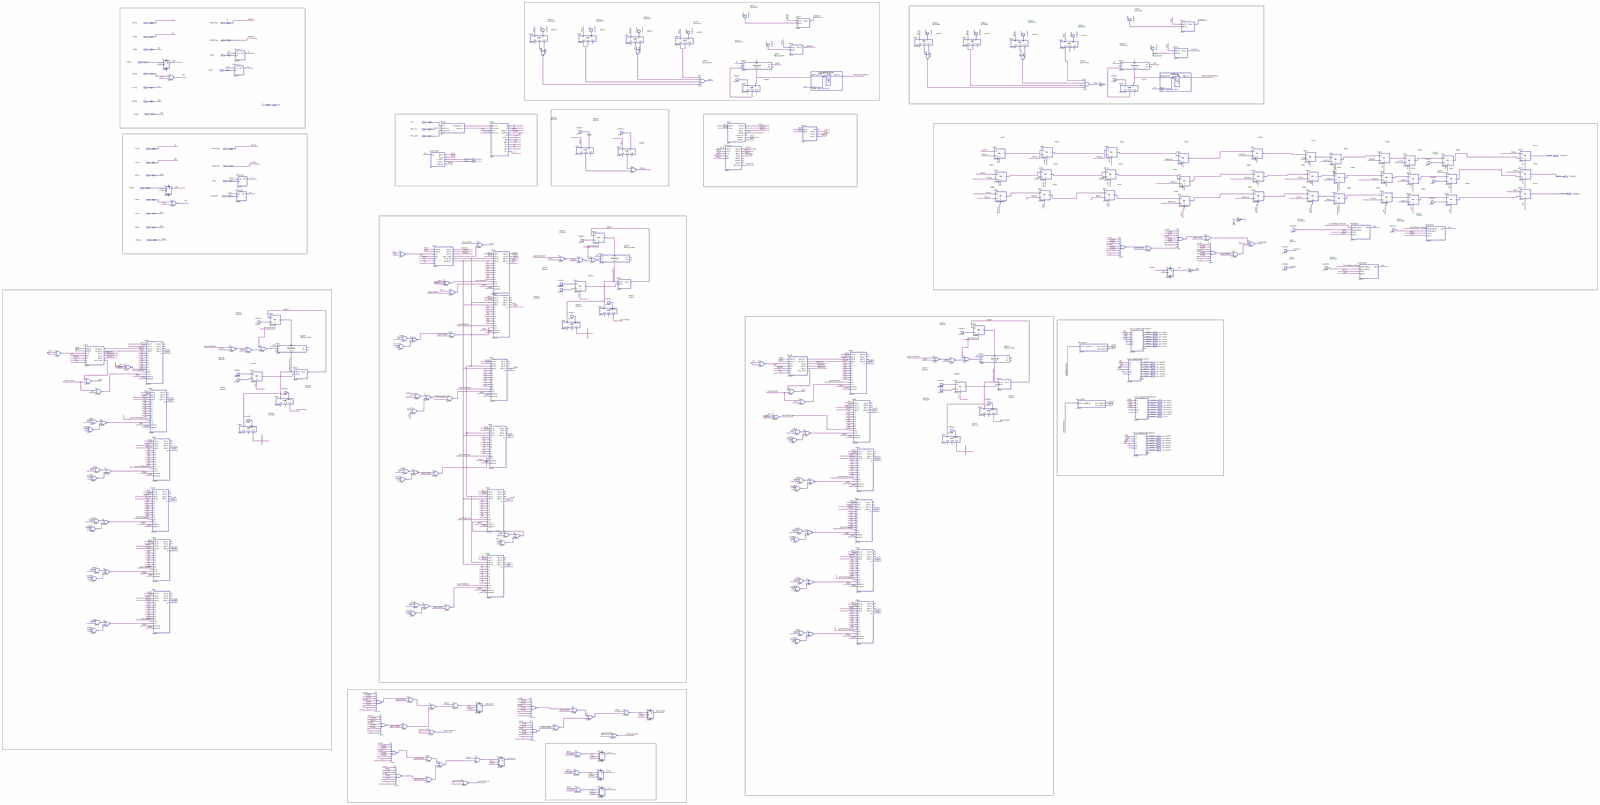
[diagram p0: schematic sheet, whole]
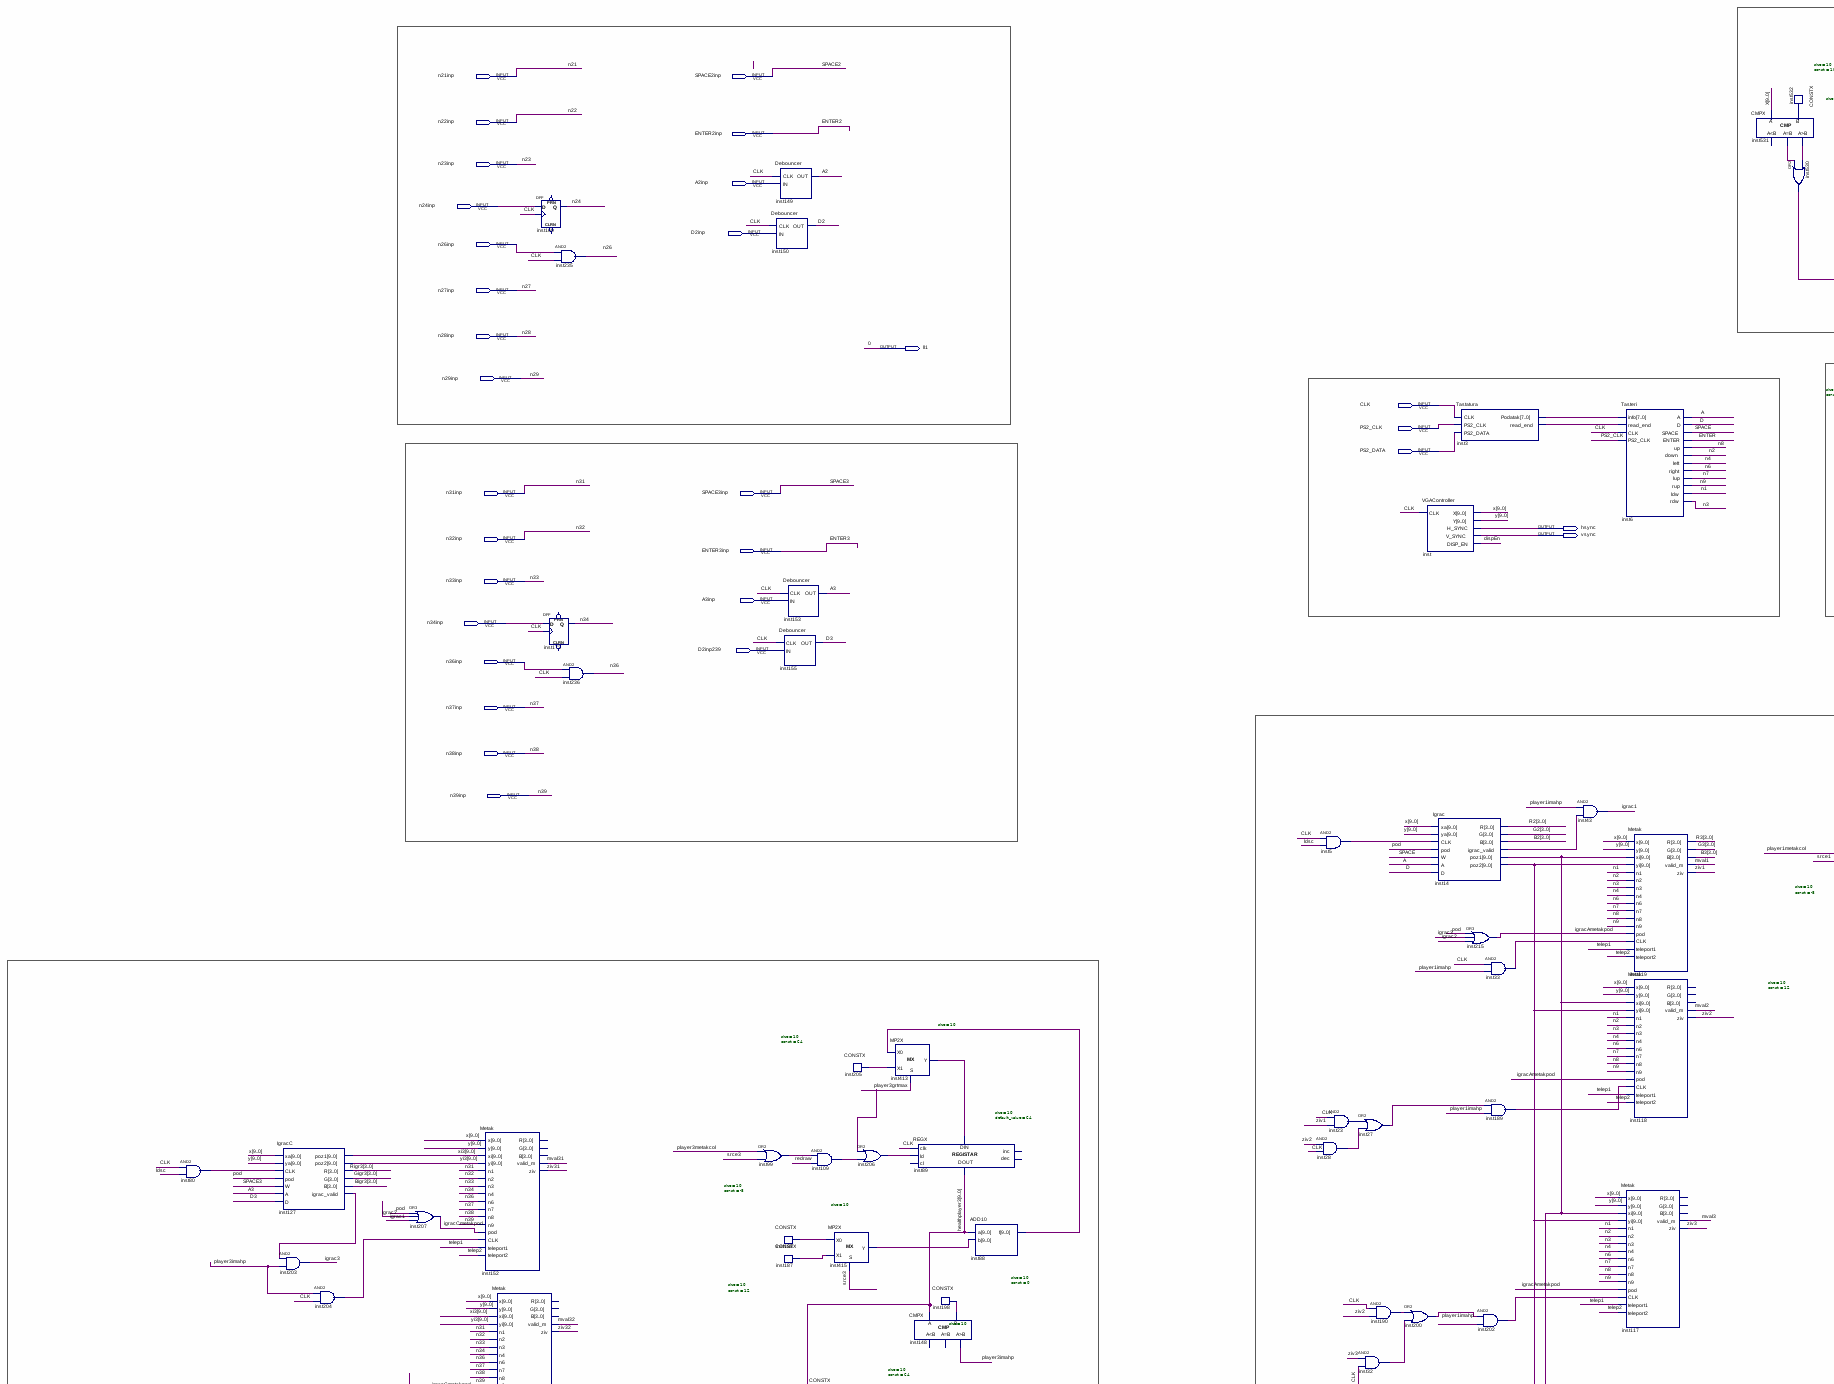
[diagram p1: schematic sheet, upper left part]
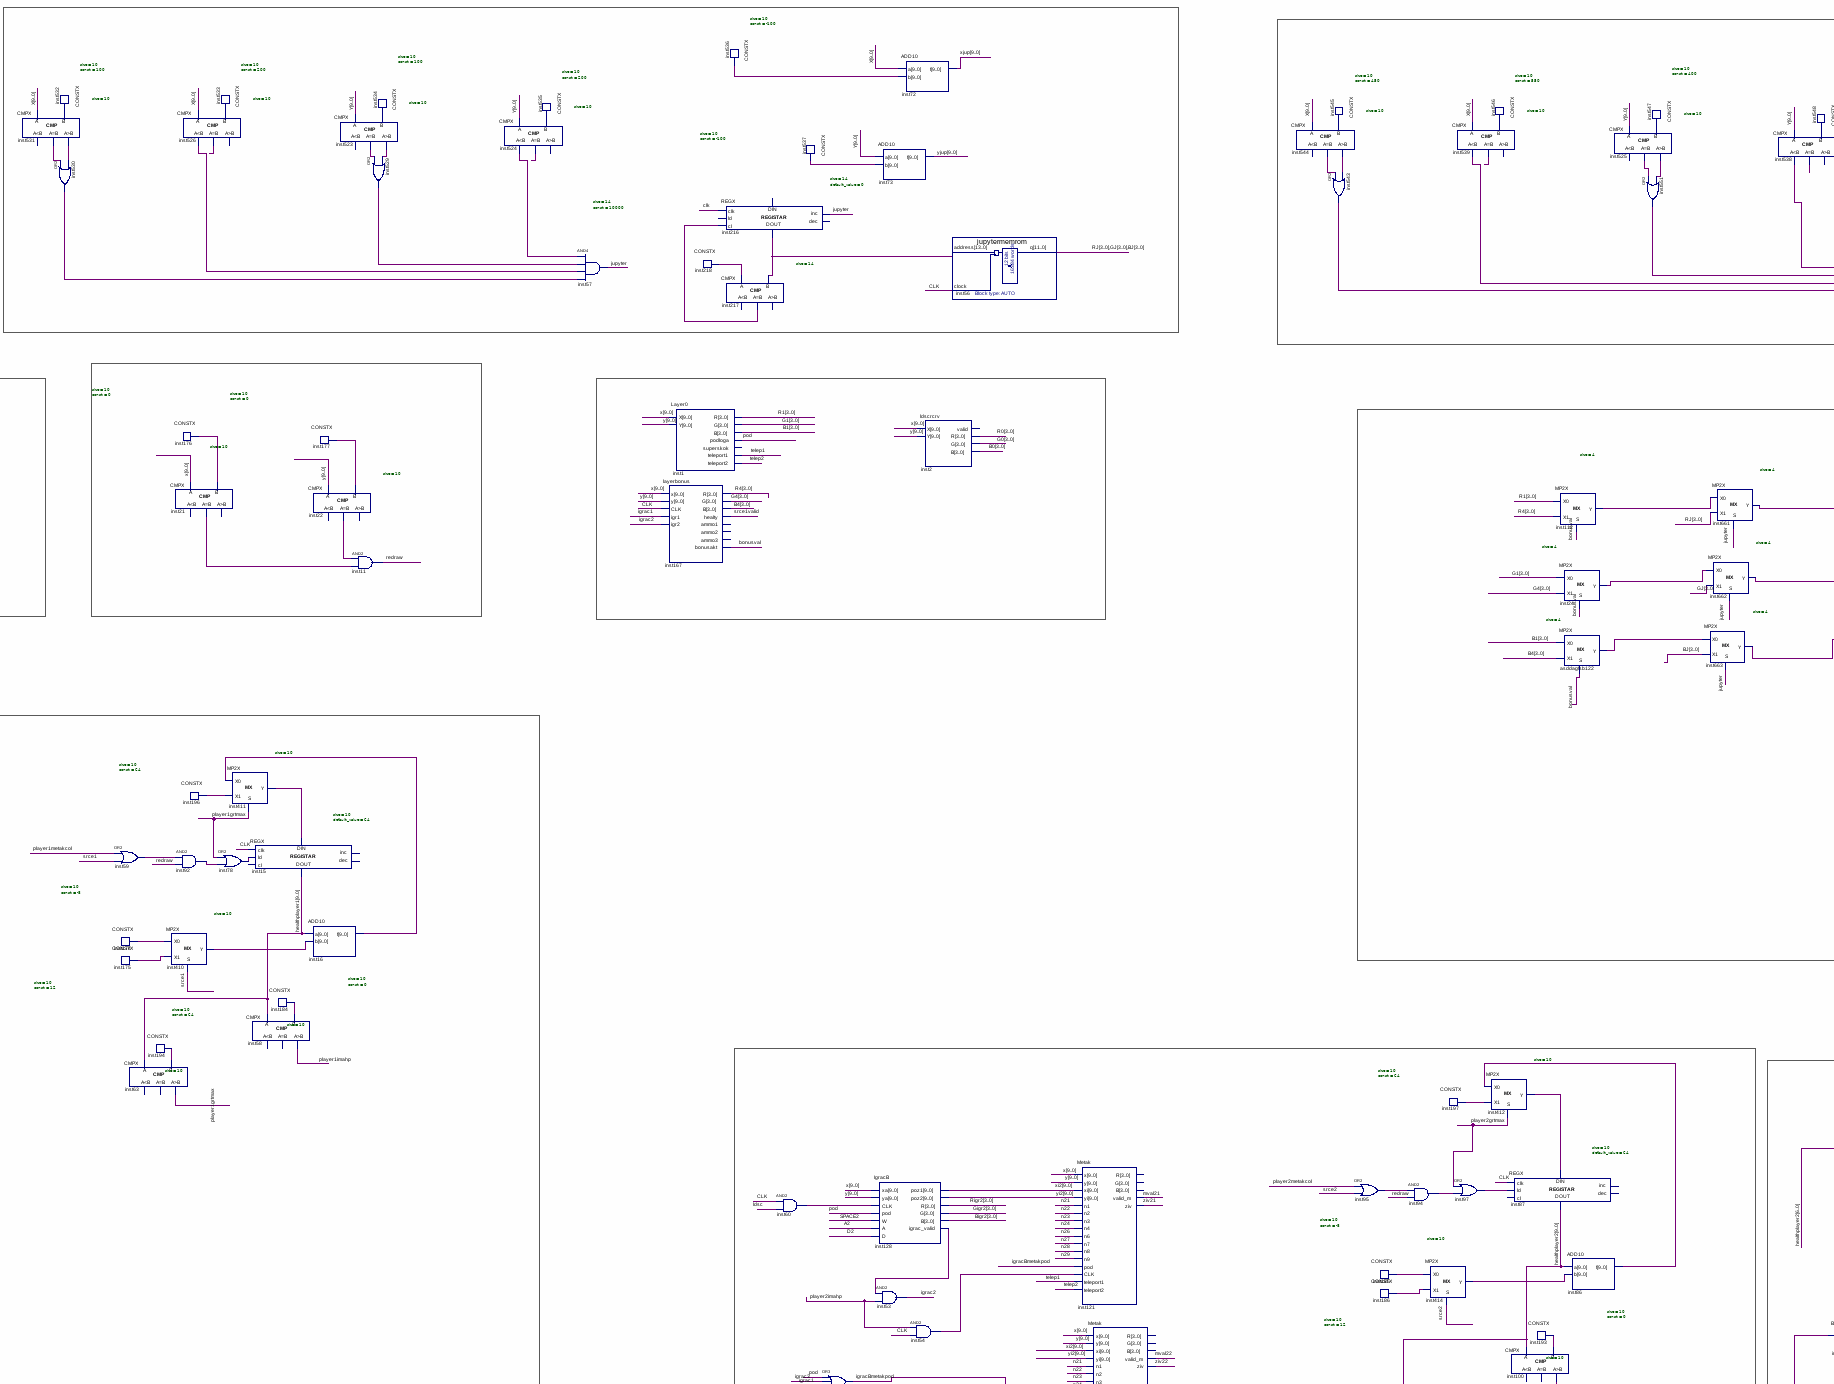
[diagram p2: schematic sheet, upper centre part]
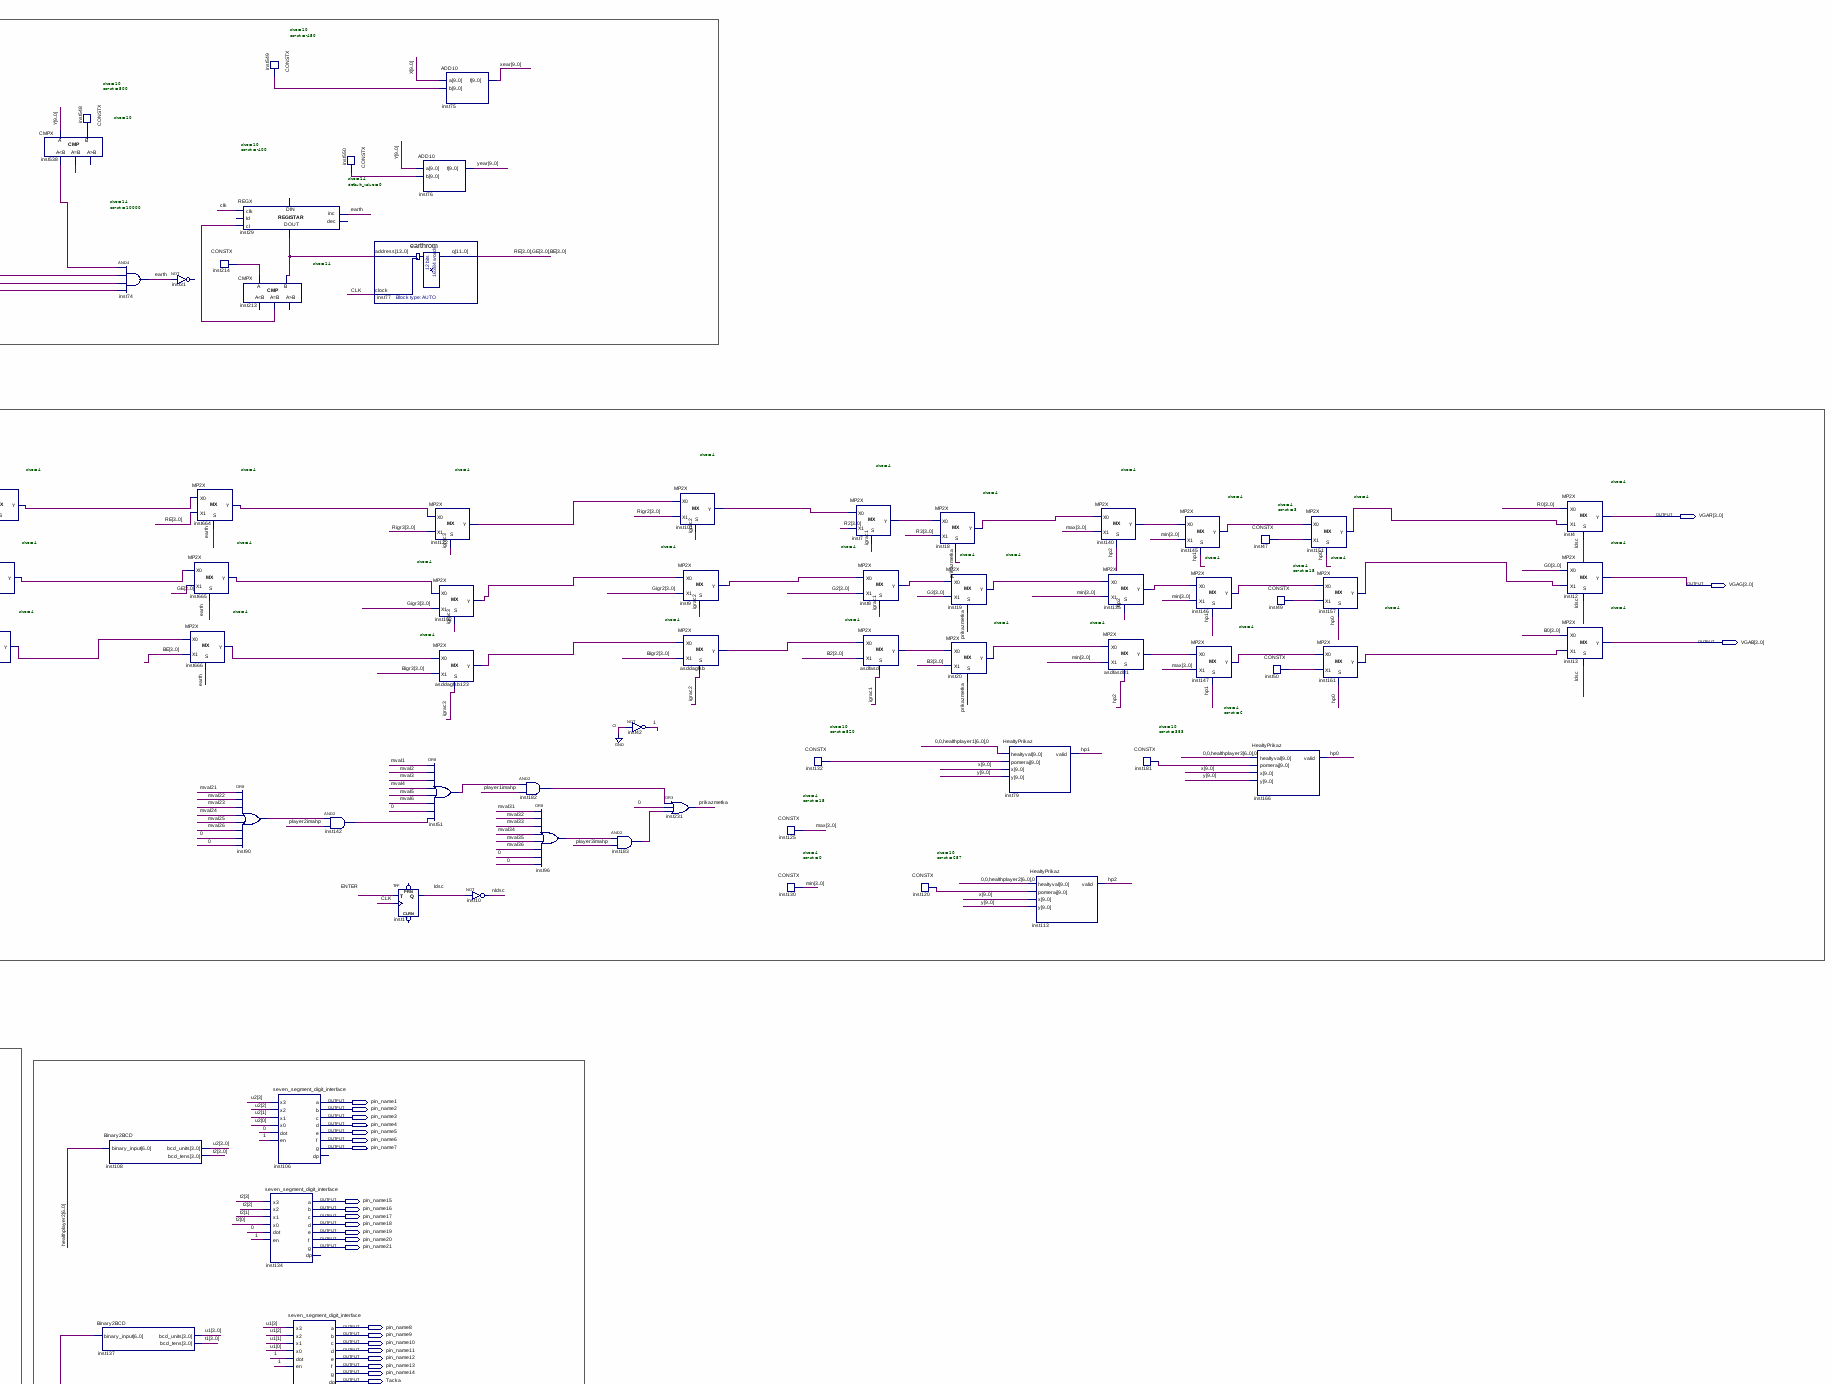
[diagram p3: schematic sheet, upper right part]
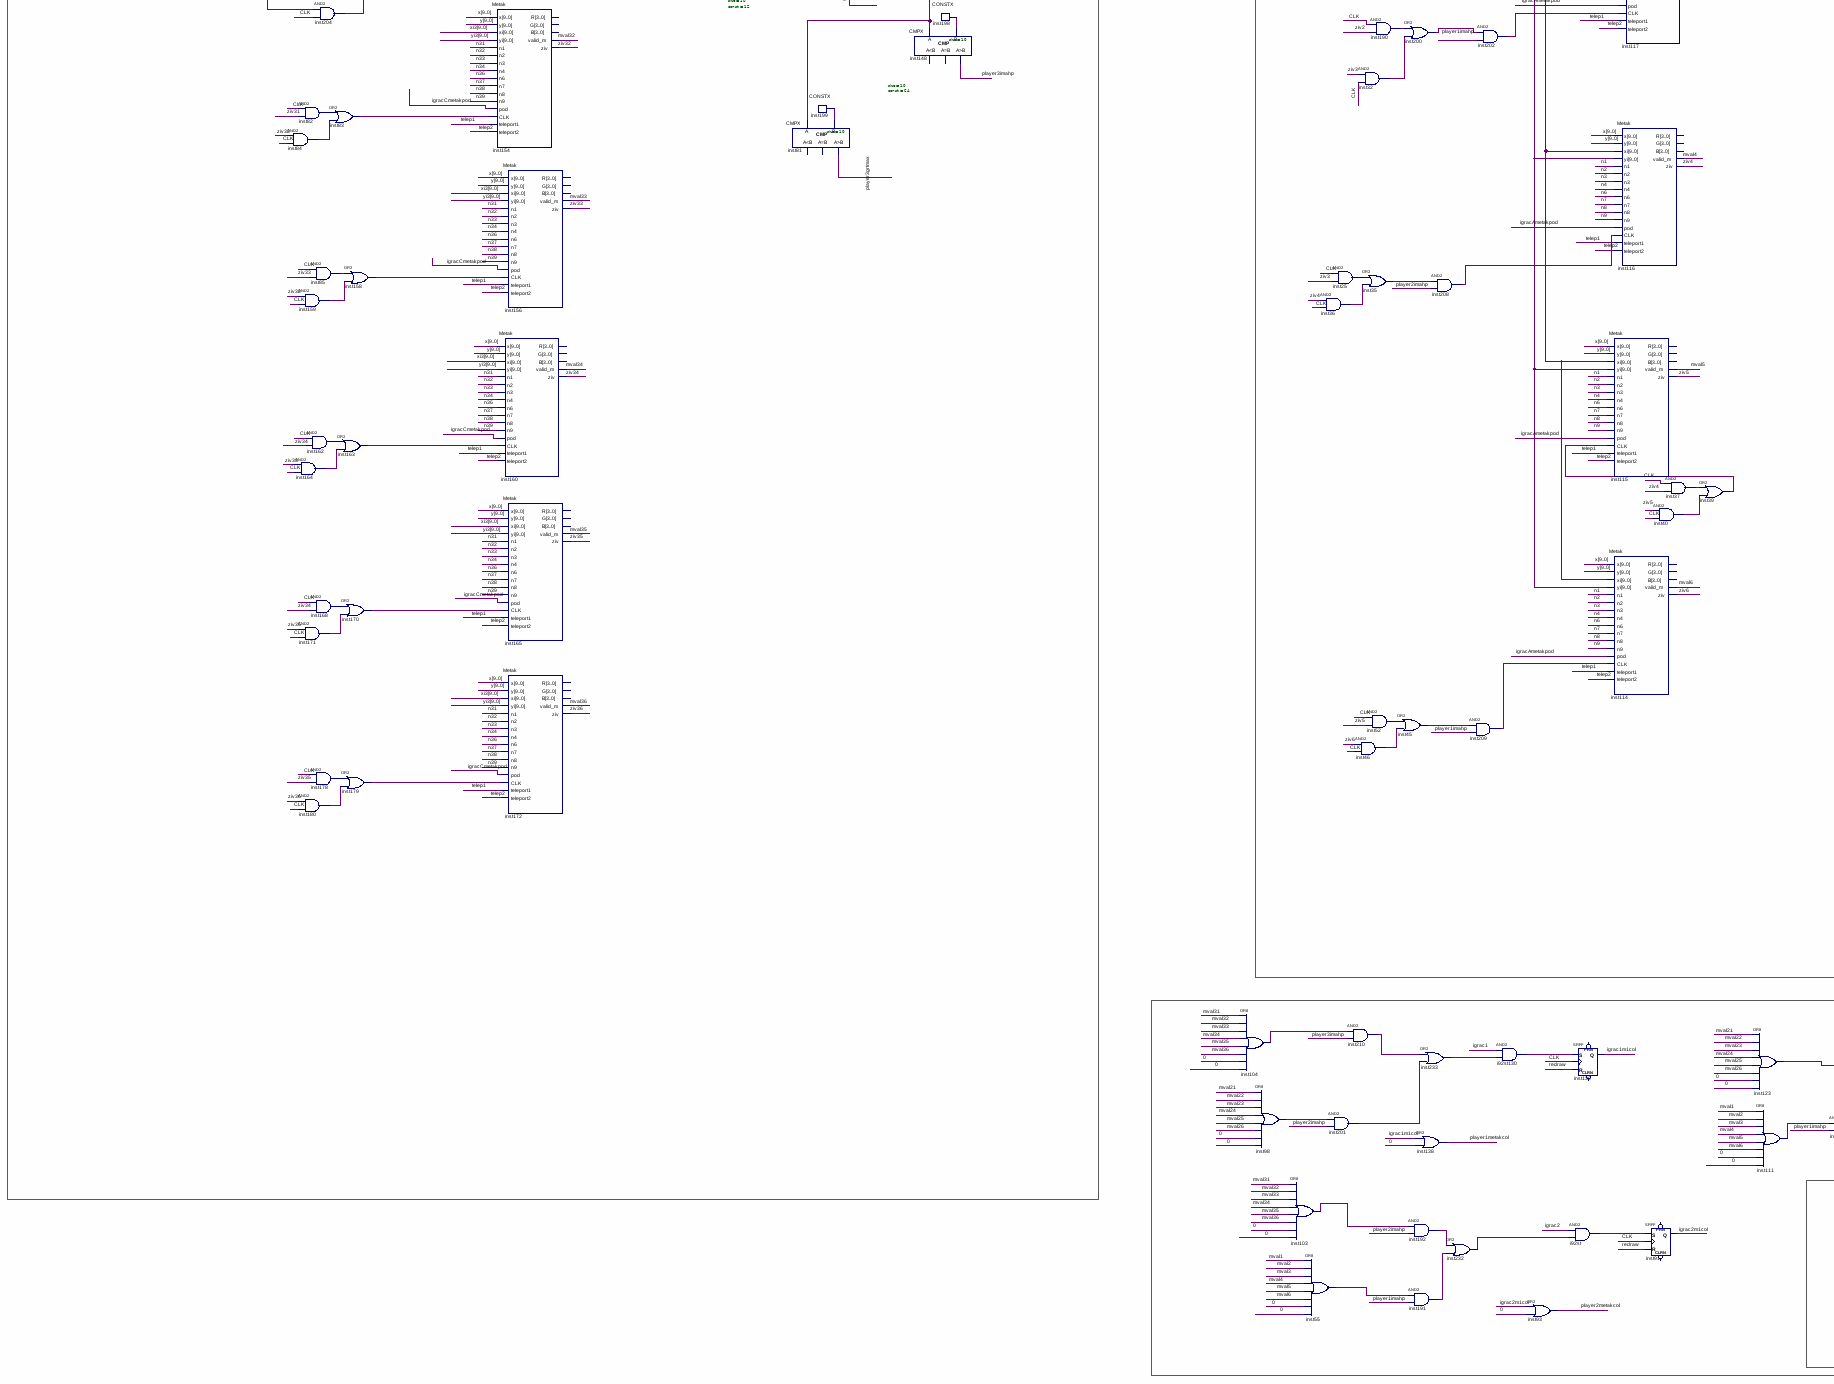
[diagram p4: schematic sheet, lower left part]
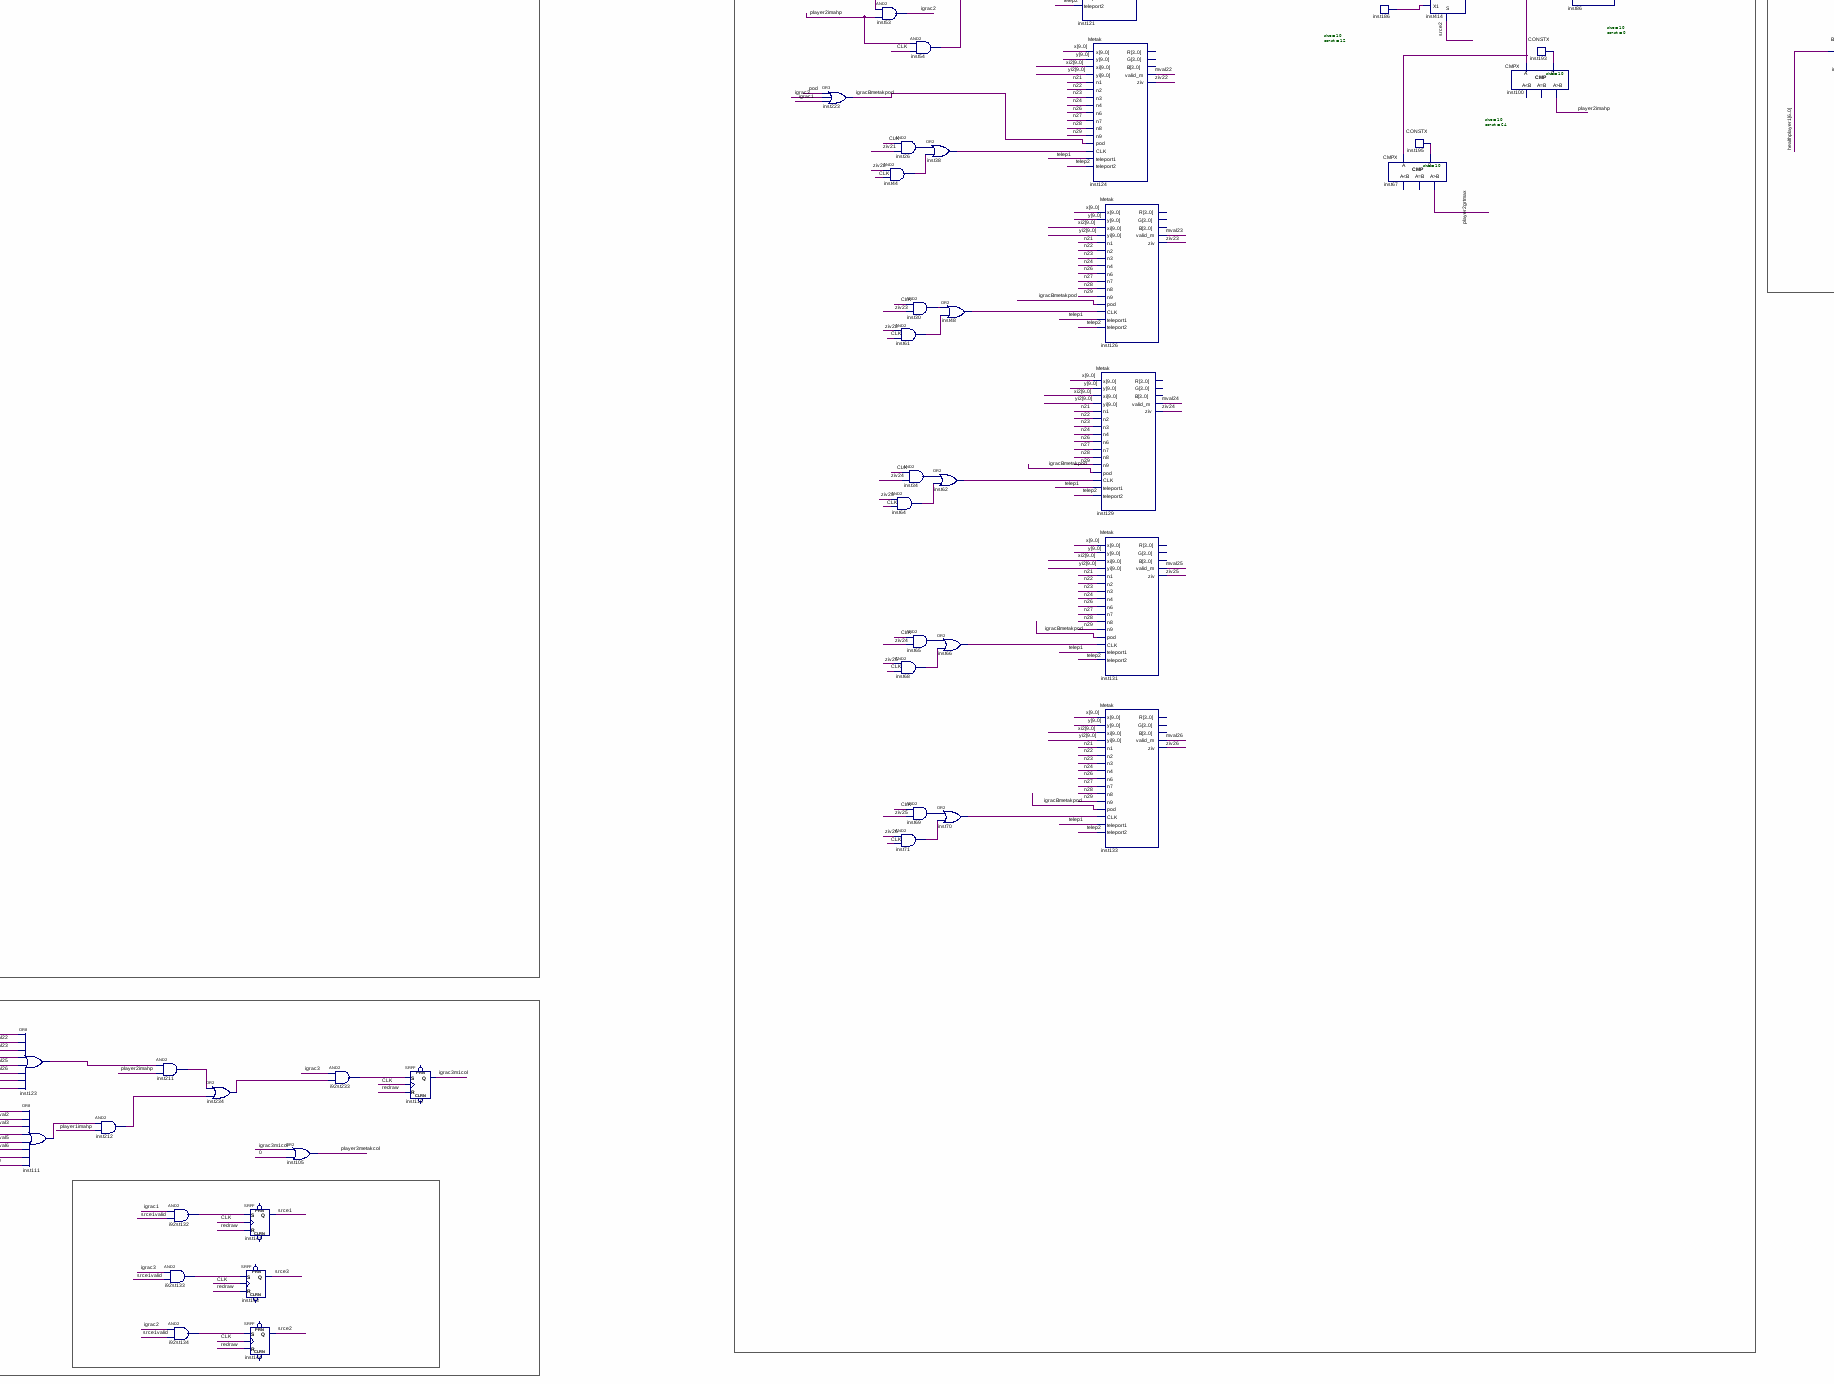
[diagram p5: schematic sheet, lower centre part]
// Quartus schematic Igrica_projekat.bdf as structural Verilog: 272 symbols, 62 pins
module Igrica_projekat (
  input  n21inp,
  input  SPACE2inp,
  input  n22inp,
  input  ENTER2inp,
  input  n23inp,
  input  A2inp,
  input  n24inp,
  input  D2inp,
  input  n26inp,
  input  n27inp,
  input  n28inp,
  input  n29inp,
  input  CLK,
  input  PS2_CLK,
  input  PS2_DATA,
  input  n31inp,
  input  SPACE3inp,
  input  n32inp,
  input  ENTER3inp,
  input  n33inp,
  input  A3inp,
  input  n34inp,
  input  D2inp239,
  input  n36inp,
  input  n37inp,
  input  n38inp,
  input  n39inp,
  output ll1,
  output [3:0] VGAR,
  output hsync,
  output vsync,
  output [3:0] VGAG,
  output [3:0] VGAB,
  output pin_name1,
  output pin_name2,
  output pin_name3,
  output pin_name4,
  output pin_name5,
  output pin_name6,
  output pin_name7,
  output pin_name15,
  output pin_name16,
  output pin_name17,
  output pin_name18,
  output pin_name19,
  output pin_name20,
  output pin_name21,
  output pin_name8,
  output pin_name9,
  output pin_name10,
  output pin_name11,
  output pin_name12,
  output pin_name13,
  output pin_name14,
  output Tacka,
  output pin_name22,
  output pin_name23,
  output pin_name24,
  output pin_name25,
  output pin_name26,
  output pin_name27,
  output pin_name28
);

  wire \1 , A, A2, A3, bonusval, D, D2, D3, dispEn, earth, ENTER, hp0, hp1, hp2, i92st130_out, i92st132_out,
       i92st133_out, i92st134_out, i92st233_out, i92st_out, igrac1, igrac1m1col, igrac2, igrac2m1col, igrac3,
       igrac3m1col, igracAmetakpod, igracBmetakpod, igracCmetakpod, inst3_read_end, inst5_out,
       inst14_igrac_valid, inst21_eq, inst22_eq, inst23_out, inst25_out, inst26_out, inst27_out, inst28_out,
       inst30_out, inst32_out, inst33_out, inst34_out, inst35_out, inst36_out, inst37_out, inst38_out,
       inst39_out, inst40_out, inst44_out, inst45_out, inst46_out, inst48_out, inst51_out, inst52_out,
       inst54_out, inst55_out, inst59_out, inst60_out, inst61_out, inst62_out, inst64_out, inst65_out,
       inst66_out, inst68_out, inst69_out, inst70_out, inst71_out, inst78_out, inst80_out, inst82_out,
       inst83_out, inst84_out, inst85_out, inst90_out, inst92_out, inst94_out, inst95_out, inst96_out,
       inst97_out, inst98_out, inst99_out, inst103_out, inst104_out, inst109_out, inst111_out, inst123_out,
       inst127_igrac_valid, inst128_igrac_valid, inst142_out, inst158_out, inst159_out, inst162_out,
       inst163_out, inst164_out, inst168_out, inst170_out, inst171_out, inst178_out, inst179_out,
       inst180_out, inst182_out, inst183_out, inst189_out, inst190_out, inst191_out, inst192_out,
       inst200_out, inst201_out, inst202_out, inst204_out, inst206_out, inst208_out, inst209_out,
       inst210_out, inst211_out, inst212_out, inst213_eq, inst217_eq, inst232_out, inst233_out, inst234_out,
       inst523_eq, inst523_gr, inst524_eq, inst524_ls, inst525_eq, inst525_gr, inst526_eq, inst526_ls,
       inst529_out, inst530_out, inst531_eq, inst531_gr, inst538_eq, inst538_ls, inst539_eq, inst539_ls,
       inst543_out, inst544_eq, inst544_gr, inst551_out, jupyter, ldsc, mval1, mval2, mval3, mval4, mval5,
       mval6, mval21, mval22, mval23, mval24, mval25, mval26, mval31, mval32, mval33, mval34, mval35, mval36,
       n1, n2, n3, n4, n6, n7, n8, n9, n24, n26, n34, n36, nldsc, player1grtmax, player1imahp,
       player1metakcol, player2grtmax, player2imahp, player2metakcol, player3grtmax, player3imahp,
       player3metakcol, pod, prikazmetka, redraw, SPACE, srce1, srce1valid, srce2, srce3, telep1, telep2,
       ziv1, ziv2, ziv3, ziv4, ziv5, ziv6, ziv21, ziv22, ziv23, ziv24, ziv25, ziv26, ziv31, ziv32, ziv33,
       ziv34, ziv35, ziv36;
  wire [3:0] asddagfsb122_y, asddagfsb123_y, asddagfsb_y, asdfasd81_y, asdfasd_y, B0, B1, B2, B3, B4, BE,
       Bigr2, Bigr3, BJ, G0, G1, G2, G3, G4, GE, Gigr2, Gigr3, GJ, inst7_y, inst8_y, inst9_y, inst18_y,
       inst19_y, inst20_y, inst24_y, inst47_data, inst49_data, inst50_data, inst101_y, inst102_y, inst112_y,
       inst122_y, inst135_y, inst140_y, inst145_y, inst146_y, inst147_y, inst151_y, inst157_y, inst161_y,
       inst661_y, inst662_y, inst663_y, inst664_y, inst665_y, inst666_y, max, min, R0, R1, R2, R3, R4, RE,
       Rigr2, Rigr3, RJ, t1, t2, u1, u2;
  wire [7:0] inst3_podatak;
  wire [9:0] healthplayer1, healthplayer2, healthplayer3, inst14_poz1, inst14_poz2, inst16_f, inst86_f,
       inst88_f, inst120_data, inst132_data, inst174_data, inst175_data, inst176_data, inst177_data,
       inst181_data, inst184_data, inst185_data, inst186_data, inst187_data, inst188_data, inst193_data,
       inst194_data, inst195_data, inst196_data, inst197_data, inst198_data, inst199_data, inst205_data,
       inst410_y, inst411_y, inst412_y, inst413_y, inst414_y, inst415_y, inst532_data, inst533_data,
       inst534_data, inst535_data, inst536_data, inst537_data, inst545_data, inst546_data, inst547_data,
       inst548_data, inst549_data, inst550_data, x, xear, xi2, xi3, xjup, y, year, yi2, yi3, yjup;
  wire [13:0] inst29_data_out, inst214_data, inst216_data_out, inst218_data;

  and inst80 (inst80_out, CLK, ldsc);
  IgracC inst127 (
    .xa(x), .ya(y), .CLK(inst80_out), .pod(pod), .W(SPACE3inp), .A(A3), .D(D3), .poz1(xi3), .poz2(yi3),
    .R(Rigr3), .G(Gigr3), .B(Bigr3), .igrac_valid(inst127_igrac_valid));
  and inst203 (igrac3, inst127_igrac_valid, player3imahp);
  and inst84 (inst84_out, ziv32, CLK);
  and inst164 (inst164_out, ziv33, CLK);
  and inst204 (inst204_out, player3imahp, CLK);
  and inst82 (inst82_out, CLK, ziv31);
  and inst85 (inst85_out, CLK, ziv33);
  and inst159 (inst159_out, ziv32, CLK);
  and inst162 (inst162_out, CLK, ziv34);
  and inst168 (inst168_out, CLK, ziv34);
  and inst171 (inst171_out, ziv35, CLK);
  and inst178 (inst178_out, CLK, ziv35);
  and inst180 (inst180_out, ziv36, CLK);
  or inst83 (inst83_out, inst82_out, inst84_out);
  or inst158 (inst158_out, inst85_out, inst159_out);
  or inst163 (inst163_out, inst162_out, inst164_out);
  or inst170 (inst170_out, inst168_out, inst171_out);
  or inst179 (inst179_out, inst178_out, inst180_out);
  or inst207 (igracCmetakpod, pod, igrac2, igrac1);
  Metak inst152 (
    .x(x), .y(y), .xi(xi3), .yi(yi3), .n1(n31inp), .n2(n32inp), .n3(n33inp), .n4(n34), .n6(n36), .n7(n37inp),
    .n8(n38inp), .n9(n39inp), .pod(igracCmetakpod), .CLK(inst204_out), .teleport1(telep1),
    .teleport2(telep2), .valid_m(mval31), .ziv(ziv31));  // open: R, G, B
  Metak inst154 (
    .x(x), .y(y), .xi(xi3), .yi(yi3), .n1(n31inp), .n2(n32inp), .n3(n33inp), .n4(n34), .n6(n36), .n7(n37inp),
    .n8(n38inp), .n9(n39inp), .pod(igracCmetakpod), .CLK(inst83_out), .teleport1(telep1), .teleport2(telep2),
    .valid_m(mval32), .ziv(ziv32));  // open: R, G, B
  Metak inst156 (
    .x(x), .y(y), .xi(xi3), .yi(yi3), .n1(n31inp), .n2(n32inp), .n3(n33inp), .n4(n34), .n6(n36), .n7(n37inp),
    .n8(n38inp), .n9(n39inp), .pod(igracCmetakpod), .CLK(inst158_out), .teleport1(telep1),
    .teleport2(telep2), .valid_m(mval33), .ziv(ziv33));  // open: R, G, B
  Metak inst160 (
    .x(x), .y(y), .xi(xi3), .yi(yi3), .n1(n31inp), .n2(n32inp), .n3(n33inp), .n4(n34), .n6(n36), .n7(n37inp),
    .n8(n38inp), .n9(n39inp), .pod(igracCmetakpod), .CLK(inst163_out), .teleport1(telep1),
    .teleport2(telep2), .valid_m(mval34), .ziv(ziv34));  // open: R, G, B
  Metak inst165 (
    .x(x), .y(y), .xi(xi3), .yi(yi3), .n1(n31inp), .n2(n32inp), .n3(n33inp), .n4(n34), .n6(n36), .n7(n37inp),
    .n8(n38inp), .n9(n39inp), .pod(igracCmetakpod), .CLK(inst170_out), .teleport1(telep1),
    .teleport2(telep2), .valid_m(mval35), .ziv(ziv35));  // open: R, G, B
  Metak inst172 (
    .x(x), .y(y), .xi(xi3), .yi(yi3), .n1(n31inp), .n2(n32inp), .n3(n33inp), .n4(n34), .n6(n36), .n7(n37inp),
    .n8(n38inp), .n9(n39inp), .pod(igracCmetakpod), .CLK(inst179_out), .teleport1(telep1),
    .teleport2(telep2), .valid_m(mval36), .ziv(ziv36));  // open: R, G, B
  DFF inst169 (.CLK(CLK), .D(n24inp), .Q(n24));  // open: CLRN, PRN
  and inst235 (n26, n26inp, CLK);
  DFF inst173 (.CLK(CLK), .D(n34inp), .Q(n34));  // open: CLRN, PRN
  and inst236 (n36, n36inp, CLK);
  Debouncer inst149 (.CLK(CLK), .IN(A2inp), .OUT(A2));
  Debouncer inst150 (.CLK(CLK), .IN(D2inp), .OUT(D2));
  Debouncer inst153 (.CLK(CLK), .IN(A3inp), .OUT(A3));
  Debouncer inst155 (.CLK(CLK), .IN(D2inp239), .OUT(D3));
  or inst99 (inst99_out, player3metakcol, srce3);
  CONSTX #(.size(10), .\const (-8)) inst188 (.data(inst188_data));
  CONSTX #(.size(10), .\const (12)) inst187 (.data(inst187_data));
  CMPX #(.size(10)) inst81 (.A(healthplayer3), .B(inst199_data), .gr(player3grtmax));  // open: ls, eq
  and inst109 (inst109_out, inst99_out, redraw);
  CONSTX #(.size(10), .\const (64)) inst199 (.data(inst199_data));
  CONSTX #(.size(10), .\const (64)) inst205 (.data(inst205_data));
  MP2X #(.size(10)) inst415 (.S(srce3), .X0(inst188_data), .X1(inst187_data), .Y(inst415_y));
  or inst206 (inst206_out, player3grtmax, inst109_out);
  MP2X #(.size(10)) inst413 (.S(player3grtmax), .X0(inst88_f), .X1(inst205_data), .Y(inst413_y));
  CMPX #(.size(10)) inst148 (.A(healthplayer3), .B(inst198_data), .gr(player3imahp));  // open: ls, eq
  REGX #(.size(10), .default_value(64)) inst89 (
    .clk(CLK), .ld(inst206_out), .data_in(inst413_y), .data_out(healthplayer3));  // open: cl, inc, dec
  CONSTX #(.size(10), .\const (0)) inst198 (.data(inst198_data));
  ADD10 inst88 (.a(healthplayer3), .b(inst415_y), .f(inst88_f));
  or inst104 (inst104_out, mval31, mval32, mval33, mval34, mval35, mval36, 1'b0, 1'b0);
  or inst98 (inst98_out, mval21, mval22, mval23, mval24, mval25, mval26, 1'b0, 1'b0);
  or inst103 (inst103_out, mval31, mval32, mval33, mval34, mval35, mval36, 1'b0, 1'b0);
  or inst55 (inst55_out, mval1, mval2, mval3, mval4, mval5, mval6, 1'b0, 1'b0);
  and inst5 (inst5_out, CLK, ldsc);
  and inst23 (inst23_out, CLK, ziv1);
  and inst28 (inst28_out, ziv2, CLK);
  and inst25 (inst25_out, CLK, ziv3);
  and inst36 (inst36_out, ziv4, CLK);
  and inst201 (inst201_out, inst98_out, player2imahp);
  or inst27 (inst27_out, inst23_out, inst28_out);
  and inst32 (inst32_out, ziv3, CLK);
  or inst35 (inst35_out, inst25_out, inst36_out);
  and inst52 (inst52_out, CLK, ziv5);
  and inst46 (inst46_out, ziv6, CLK);
  and inst210 (inst210_out, inst104_out, player3imahp);
  and inst190 (inst190_out, CLK, ziv2);
  or inst45 (inst45_out, inst52_out, inst46_out);
  VGAController inst (.CLK(CLK), .X(x), .Y(y), .H_SYNC(hsync), .V_SYNC(vsync), .DISP_EN(dispEn));
  or inst200 (inst200_out, inst190_out, inst32_out);
  or inst233 (inst233_out, inst210_out, inst201_out);
  or inst138 (player1metakcol, igrac1m1col, 1'b0);
  and inst192 (inst192_out, inst103_out, player2imahp);
  and inst191 (inst191_out, inst55_out, player1imahp);
  Tastatura inst3 (
    .CLK(CLK), .PS2_CLK(PS2_CLK), .PS2_DATA(PS2_DATA), .Podatak(inst3_podatak), .read_end(inst3_read_end));
  Igrac inst14 (
    .xa(x), .ya(y), .CLK(inst5_out), .pod(pod), .W(SPACE), .A(A), .D(D), .R(R2), .G(G2), .B(B2),
    .igrac_valid(inst14_igrac_valid), .poz1(inst14_poz1), .poz2(inst14_poz2));
  and inst208 (inst208_out, inst35_out, player2imahp);
  or inst232 (inst232_out, inst192_out, inst191_out);
  or inst215 (igracAmetakpod, pod, igrac3, igrac2);
  and inst33 (inst33_out, CLK, player1imahp);
  and inst189 (inst189_out, inst27_out, player1imahp);
  and inst202 (inst202_out, inst200_out, player1imahp);
  and inst209 (inst209_out, inst45_out, player1imahp);
  and i92st130 (i92st130_out, igrac1, inst233_out);
  or inst93 (player2metakcol, igrac2m1col, 1'b0);
  and inst43 (igrac1, player1imahp, inst14_igrac_valid);
  SRFF inst139 (.S(i92st130_out), .R(redraw), .CLK(CLK), .Q(igrac1m1col));  // open: PRN, CLRN
  and i92st (i92st_out, igrac2, inst232_out);
  Metak inst115 (
    .x(x), .y(y), .xi(inst14_poz1), .yi(inst14_poz2), .n1(n1), .n2(n2), .n3(n3), .n4(n4), .n6(n6), .n7(n7),
    .n8(n8), .n9(n9), .pod(igracAmetakpod), .CLK(inst39_out), .teleport1(telep1), .teleport2(telep2),
    .valid_m(mval5), .ziv(ziv5));  // open: R, G, B
  Metak inst114 (
    .x(x), .y(y), .xi(inst14_poz1), .yi(inst14_poz2), .n1(n1), .n2(n2), .n3(n3), .n4(n4), .n6(n6), .n7(n7),
    .n8(n8), .n9(n9), .pod(igracAmetakpod), .CLK(inst209_out), .teleport1(telep1), .teleport2(telep2),
    .valid_m(mval6), .ziv(ziv6));  // open: R, G, B
  Tasteri inst6 (
    .info(inst3_podatak), .read_end(inst3_read_end), .CLK(CLK), .PS2_CLK(PS2_CLK), .A(A), .D(D),
    .SPACE(SPACE), .ENTER(ENTER), .up(n8), .down(n2), .left(n4), .right(n6), .lup(n7), .rup(n9), .ldw(n1),
    .rdw(n3));
  Metak inst119 (
    .x(x), .y(y), .xi(inst14_poz1), .yi(inst14_poz2), .n1(n1), .n2(n2), .n3(n3), .n4(n4), .n6(n6), .n7(n7),
    .n8(n8), .n9(n9), .pod(igracAmetakpod), .CLK(inst33_out), .teleport1(telep1), .teleport2(telep2), .R(R3),
    .G(G3), .B(B3), .valid_m(mval1), .ziv(ziv1));
  Metak inst118 (
    .x(x), .y(y), .xi(inst14_poz1), .yi(inst14_poz2), .n1(n1), .n2(n2), .n3(n3), .n4(n4), .n6(n6), .n7(n7),
    .n8(n8), .n9(n9), .pod(igracAmetakpod), .CLK(inst189_out), .teleport1(telep1), .teleport2(telep2),
    .valid_m(mval2), .ziv(ziv2));  // open: R, G, B
  Metak inst117 (
    .x(x), .y(y), .xi(inst14_poz1), .yi(inst14_poz2), .n1(n1), .n2(n2), .n3(n3), .n4(n4), .n6(n6), .n7(n7),
    .n8(n8), .n9(n9), .pod(igracAmetakpod), .CLK(inst202_out), .teleport1(telep1), .teleport2(telep2),
    .valid_m(mval3), .ziv(ziv3));  // open: R, G, B
  Metak inst116 (
    .x(x), .y(y), .xi(inst14_poz1), .yi(inst14_poz2), .n1(n1), .n2(n2), .n3(n3), .n4(n4), .n6(n6), .n7(n7),
    .n8(n8), .n9(n9), .pod(igracAmetakpod), .CLK(inst208_out), .teleport1(telep1), .teleport2(telep2),
    .valid_m(mval4), .ziv(ziv4));  // open: R, G, B
  and inst37 (inst37_out, CLK, ziv4);
  and inst40 (inst40_out, ziv5, CLK);
  SRFF inst91 (.S(i92st_out), .R(redraw), .CLK(CLK), .Q(igrac2m1col));  // open: PRN, CLRN
  or inst39 (inst39_out, inst37_out, inst40_out);
  CMPX #(.size(10)) inst531 (.A(x), .B(inst532_data), .eq(inst531_eq), .gr(inst531_gr));  // open: ls
  or inst123 (inst123_out, mval21, mval22, mval23, mval24, mval25, mval26, 1'b0, 1'b0);
  or inst111 (inst111_out, mval1, mval2, mval3, mval4, mval5, mval6, 1'b0, 1'b0);
  CONSTX #(.size(10), .\const (100)) inst532 (.data(inst532_data));
  or inst530 (inst530_out, inst531_eq, inst531_gr);
  or inst59 (inst59_out, player1metakcol, srce1);
  CONSTX #(.size(10), .\const (-8)) inst174 (.data(inst174_data));
  CONSTX #(.size(10), .\const (12)) inst175 (.data(inst175_data));
  CMPX #(.size(10)) inst63 (.A(healthplayer1), .B(inst194_data), .gr(player1grtmax));  // open: ls, eq
  and inst212 (inst212_out, inst111_out, player1imahp);
  CONSTX #(.size(10), .\const (64)) inst194 (.data(inst194_data));
  CMPX #(.size(10)) inst526 (.A(x), .B(inst533_data), .ls(inst526_ls), .eq(inst526_eq));  // open: gr
  CONSTX #(.size(10), .\const (0)) inst176 (.data(inst176_data));
  CMPX #(.size(10)) inst21 (.A(x), .B(inst176_data), .eq(inst21_eq));  // open: ls, gr
  CONSTX #(.size(10), .\const (64)) inst196 (.data(inst196_data));
  and inst92 (inst92_out, inst59_out, redraw);
  MP2X #(.size(10)) inst410 (.S(srce1), .X0(inst174_data), .X1(inst175_data), .Y(inst410_y));
  and inst211 (inst211_out, inst123_out, player2imahp);
  and i92st132 (i92st132_out, igrac1, srce1valid);
  and i92st133 (i92st133_out, igrac3, srce1valid);
  and i92st134 (i92st134_out, igrac2, srce1valid);
  CONSTX #(.size(10), .\const (200)) inst533 (.data(inst533_data));
  or inst234 (inst234_out, inst211_out, inst212_out);
  MP2X #(.size(10)) inst411 (.S(player1grtmax), .X0(inst16_f), .X1(inst196_data), .Y(inst411_y));
  or inst78 (inst78_out, player1grtmax, inst92_out);
  CMPX #(.size(10)) inst58 (.A(healthplayer1), .B(inst184_data), .gr(player1imahp));  // open: ls, eq
  SRFF inst141 (.S(i92st132_out), .R(redraw), .CLK(CLK), .Q(srce1));  // open: PRN, CLRN
  SRFF inst143 (.S(i92st133_out), .R(redraw), .CLK(CLK), .Q(srce3));  // open: PRN, CLRN
  SRFF inst144 (.S(i92st134_out), .R(redraw), .CLK(CLK), .Q(srce2));  // open: PRN, CLRN
  REGX #(.size(10), .default_value(64)) inst15 (
    .clk(CLK), .ld(inst78_out), .data_in(inst411_y), .data_out(healthplayer1));  // open: cl, inc, dec
  CONSTX #(.size(10), .\const (0)) inst184 (.data(inst184_data));
  CMPX #(.size(10)) inst22 (.A(y), .B(inst177_data), .eq(inst22_eq));  // open: ls, gr
  ADD10 inst16 (.a(healthplayer1), .b(inst410_y), .f(inst16_f));
  or inst105 (player3metakcol, igrac3m1col, 1'b0);
  CMPX #(.size(10)) inst523 (.A(y), .B(inst534_data), .eq(inst523_eq), .gr(inst523_gr));  // open: ls
  CONSTX #(.size(10), .\const (0)) inst177 (.data(inst177_data));
  and i92st233 (i92st233_out, igrac3, inst234_out);
  or inst529 (inst529_out, inst523_eq, inst523_gr);
  and inst11 (redraw, inst22_eq, inst21_eq);
  CONSTX #(.size(10), .\const (100)) inst534 (.data(inst534_data));
  SRFF inst110 (.S(i92st233_out), .R(redraw), .CLK(CLK), .Q(igrac3m1col));  // open: PRN, CLRN
  CMPX #(.size(10)) inst524 (.A(y), .B(inst535_data), .ls(inst524_ls), .eq(inst524_eq));  // open: gr
  CONSTX #(.size(10), .\const (200)) inst535 (.data(inst535_data));
  and inst57 (jupyter, inst524_ls, inst529_out, inst526_ls, inst530_out);
  Layer0 inst1 (
    .X(x), .Y(y), .R(R1), .G(G1), .B(B1), .podloga(pod), .teleport1(telep1), .teleport2(telep2));  // open: superskok
  layerbonus inst167 (
    .x(x), .y(y), .CLK(CLK), .igr1(igrac1), .igr2(igrac2), .R(R4), .G(G4), .B(B4), .healty(srce1valid),
    .bonusakt(bonusval));  // open: ammo1, ammo2, ammo3
  CONSTX #(.size(14), .\const (10000)) inst218 (.data(inst218_data));
  CONSTX #(.size(10), .\const (-100)) inst536 (.data(inst536_data));
  REGX #(.size(14), .default_value(0)) inst216 (
    .clk(CLK), .cl(inst217_eq), .inc(jupyter), .data_out(inst216_data_out));  // open: ld, dec, data_in
  CMPX #(.size(14)) inst217 (.A(inst218_data), .B(inst216_data_out), .eq(inst217_eq));  // open: ls, gr
  and inst60 (inst60_out, CLK, ldsc);
  CONSTX #(.size(10), .\const (-100)) inst537 (.data(inst537_data));
  or inst223 (igracBmetakpod, pod, igrac3, igrac1);
  ADD10 inst73 (.a(y), .b(inst537_data), .f(yjup));
  IgracB inst128 (
    .xa(x), .ya(y), .CLK(inst60_out), .pod(pod), .W(SPACE2inp), .A(A2), .D(D2), .poz1(xi2), .poz2(yi2),
    .R(Rigr2), .G(Gigr2), .B(Bigr2), .igrac_valid(inst128_igrac_valid));
  and inst53 (igrac2, inst128_igrac_valid, player2imahp);
  and inst44 (inst44_out, ziv22, CLK);
  ADD10 inst72 (.a(x), .b(inst536_data), .f(xjup));
  ldscrcrv inst2 (.X(x), .Y(y), .R(R0), .G(G0), .B(B0));  // open: valid
  and inst54 (inst54_out, player2imahp, CLK);
  and inst26 (inst26_out, CLK, ziv21);
  and inst30 (inst30_out, CLK, ziv23);
  and inst61 (inst61_out, ziv22, CLK);
  and inst34 (inst34_out, CLK, ziv24);
  and inst64 (inst64_out, ziv23, CLK);
  and inst65 (inst65_out, CLK, ziv24);
  and inst68 (inst68_out, ziv25, CLK);
  and inst69 (inst69_out, CLK, ziv25);
  and inst71 (inst71_out, ziv26, CLK);
  or inst38 (inst38_out, inst26_out, inst44_out);
  or inst48 (inst48_out, inst30_out, inst61_out);
  or inst62 (inst62_out, inst34_out, inst64_out);
  or inst66 (inst66_out, inst65_out, inst68_out);
  or inst70 (inst70_out, inst69_out, inst71_out);
  jupytermemrom inst56 (.address(inst216_data_out), .clock(CLK), .q({RJ, GJ, BJ}));
  Metak inst121 (
    .x(x), .y(y), .xi(xi2), .yi(yi2), .n1(n21inp), .n2(n22inp), .n3(n23inp), .n4(n24), .n6(n26), .n7(n27inp),
    .n8(n28inp), .n9(n29inp), .pod(igracBmetakpod), .CLK(inst54_out), .teleport1(telep1), .teleport2(telep2),
    .valid_m(mval21), .ziv(ziv21));  // open: R, G, B
  Metak inst124 (
    .x(x), .y(y), .xi(xi2), .yi(yi2), .n1(n21inp), .n2(n22inp), .n3(n23inp), .n4(n24), .n6(n26), .n7(n27inp),
    .n8(n28inp), .n9(n29inp), .pod(igracBmetakpod), .CLK(inst38_out), .teleport1(telep1), .teleport2(telep2),
    .valid_m(mval22), .ziv(ziv22));  // open: R, G, B
  Metak inst126 (
    .x(x), .y(y), .xi(xi2), .yi(yi2), .n1(n21inp), .n2(n22inp), .n3(n23inp), .n4(n24), .n6(n26), .n7(n27inp),
    .n8(n28inp), .n9(n29inp), .pod(igracBmetakpod), .CLK(inst48_out), .teleport1(telep1), .teleport2(telep2),
    .valid_m(mval23), .ziv(ziv23));  // open: R, G, B
  Metak inst129 (
    .x(x), .y(y), .xi(xi2), .yi(yi2), .n1(n21inp), .n2(n22inp), .n3(n23inp), .n4(n24), .n6(n26), .n7(n27inp),
    .n8(n28inp), .n9(n29inp), .pod(igracBmetakpod), .CLK(inst62_out), .teleport1(telep1), .teleport2(telep2),
    .valid_m(mval24), .ziv(ziv24));  // open: R, G, B
  Metak inst131 (
    .x(x), .y(y), .xi(xi2), .yi(yi2), .n1(n21inp), .n2(n22inp), .n3(n23inp), .n4(n24), .n6(n26), .n7(n27inp),
    .n8(n28inp), .n9(n29inp), .pod(igracBmetakpod), .CLK(inst66_out), .teleport1(telep1), .teleport2(telep2),
    .valid_m(mval25), .ziv(ziv25));  // open: R, G, B
  Metak inst133 (
    .x(x), .y(y), .xi(xi2), .yi(yi2), .n1(n21inp), .n2(n22inp), .n3(n23inp), .n4(n24), .n6(n26), .n7(n27inp),
    .n8(n28inp), .n9(n29inp), .pod(igracBmetakpod), .CLK(inst70_out), .teleport1(telep1), .teleport2(telep2),
    .valid_m(mval26), .ziv(ziv26));  // open: R, G, B
  CMPX #(.size(10)) inst544 (.A(x), .B(inst545_data), .eq(inst544_eq), .gr(inst544_gr));  // open: ls
  CONSTX #(.size(10), .\const (450)) inst545 (.data(inst545_data));
  or inst543 (inst543_out, inst544_eq, inst544_gr);
  or inst95 (inst95_out, player2metakcol, srce2);
  CONSTX #(.size(10), .\const (-8)) inst185 (.data(inst185_data));
  CONSTX #(.size(10), .\const (12)) inst186 (.data(inst186_data));
  and inst94 (inst94_out, inst95_out, redraw);
  CONSTX #(.size(10), .\const (64)) inst195 (.data(inst195_data));
  CMPX #(.size(10)) inst67 (.A(healthplayer2), .B(inst195_data), .gr(player2grtmax));  // open: ls, eq
  CONSTX #(.size(10), .\const (64)) inst197 (.data(inst197_data));
  MP2X #(.size(10)) inst414 (.S(srce2), .X0(inst185_data), .X1(inst186_data), .Y(inst414_y));
  CMPX #(.size(10)) inst539 (.A(x), .B(inst546_data), .ls(inst539_ls), .eq(inst539_eq));  // open: gr
  or inst97 (inst97_out, player2grtmax, inst94_out);
  CONSTX #(.size(10), .\const (550)) inst546 (.data(inst546_data));
  MP2X #(.size(10)) inst412 (.S(player2grtmax), .X0(inst86_f), .X1(inst197_data), .Y(inst412_y));
  REGX #(.size(10), .default_value(64)) inst87 (
    .clk(CLK), .ld(inst97_out), .data_in(inst412_y), .data_out(healthplayer2));  // open: cl, inc, dec
  CONSTX #(.size(10), .\const (0)) inst193 (.data(inst193_data));
  CMPX #(.size(10)) inst100 (.A(healthplayer2), .B(inst193_data), .gr(player2imahp));  // open: ls, eq
  MP2X #(.size(4)) inst112 (.S(bonusval), .X0(R1), .X1(R4), .Y(inst112_y));
  MP2X #(.size(4)) inst24 (.S(bonusval), .X0(G1), .X1(G4), .Y(inst24_y));
  MP2X #(.size(4)) asddagfsb122 (.S(bonusval), .X0(B1), .X1(B4), .Y(asddagfsb122_y));
  ADD10 inst86 (.a(healthplayer2), .b(inst414_y), .f(inst86_f));
  CMPX #(.size(10)) inst525 (.A(y), .B(inst547_data), .eq(inst525_eq), .gr(inst525_gr));  // open: ls
  CONSTX #(.size(10), .\const (400)) inst547 (.data(inst547_data));
  or inst551 (inst551_out, inst525_eq, inst525_gr);
  MP2X #(.size(4)) inst661 (.S(jupyter), .X0(inst112_y), .X1(RJ), .Y(inst661_y));
  MP2X #(.size(4)) inst662 (.S(jupyter), .X0(inst24_y), .X1(GJ), .Y(inst662_y));
  MP2X #(.size(4)) inst663 (.S(jupyter), .X0(asddagfsb122_y), .X1(BJ), .Y(inst663_y));
  CMPX #(.size(10)) inst538 (.A(y), .B(inst548_data), .ls(inst538_ls), .eq(inst538_eq));  // open: gr
  CONSTX #(.size(10), .\const (500)) inst548 (.data(inst548_data));
  Binary2BCD inst108 (.binary_input(healthplayer2[6:0]), .bcd_units(u2), .bcd_tens(t2));
  Binary2BCD inst137 (.binary_input(healthplayer1[6:0]), .bcd_units(u1), .bcd_tens(t1));
  and inst74 (earth, inst538_ls, inst551_out, inst539_ls, inst543_out);
  // NOT inst31 has open pins: IN=earth, OUT=open
  MP2X #(.size(4)) inst664 (.S(earth), .X0(inst661_y), .X1(RE), .Y(inst664_y));
  MP2X #(.size(4)) inst665 (.S(earth), .X0(inst662_y), .X1(GE), .Y(inst665_y));
  MP2X #(.size(4)) inst666 (.S(earth), .X0(inst663_y), .X1(BE), .Y(inst666_y));
  CONSTX #(.size(14), .\const (10000)) inst214 (.data(inst214_data));
  REGX #(.size(14), .default_value(0)) inst29 (
    .clk(CLK), .cl(inst213_eq), .inc(earth), .data_out(inst29_data_out));  // open: ld, dec, data_in
  CMPX #(.size(14)) inst213 (.A(inst214_data), .B(inst29_data_out), .eq(inst213_eq));  // open: ls, gr
  or inst90 (inst90_out, mval21, mval22, mval23, mval24, mval25, mval26, 1'b0, 1'b0);
  CONSTX #(.size(10), .\const (-450)) inst549 (.data(inst549_data));
  seven_segment_digit_interface inst106 (
    .x3(u2[3]), .x2(u2[2]), .x1(u2[1]), .x0(u2[0]), .dot(1'b0), .en(\1 ), .a(pin_name1), .b(pin_name2),
    .c(pin_name3), .d(pin_name4), .e(pin_name5), .f(pin_name6), .g(pin_name7));  // open: dp
  seven_segment_digit_interface inst134 (
    .x3(t2[3]), .x2(t2[2]), .x1(t2[1]), .x0(t2[0]), .dot(1'b0), .en(\1 ), .a(pin_name15), .b(pin_name16),
    .c(pin_name17), .d(pin_name18), .e(pin_name19), .f(pin_name20), .g(pin_name21));  // open: dp
  seven_segment_digit_interface inst107 (
    .x3(u1[3]), .x2(u1[2]), .x1(u1[1]), .x0(u1[0]), .dot(\1 ), .en(\1 ), .a(pin_name8), .b(pin_name9),
    .c(pin_name10), .d(pin_name11), .e(pin_name12), .f(pin_name13), .g(pin_name14), .dp(Tacka));
  seven_segment_digit_interface inst136 (
    .x3(t1[3]), .x2(t1[2]), .x1(t1[1]), .x0(t1[0]), .dot(1'b0), .en(\1 ), .a(pin_name22), .b(pin_name23),
    .c(pin_name24), .d(pin_name25), .e(pin_name26), .f(pin_name27), .g(pin_name28));  // open: dp
  CONSTX #(.size(10), .\const (-400)) inst550 (.data(inst550_data));
  and inst142 (inst142_out, inst90_out, player2imahp);
  earthrom inst77 (.address(inst29_data_out), .clock(CLK), .q({RE, GE, BE}));
  TFF inst17 (.T(ENTER), .CLK(CLK), .Q(ldsc));  // open: PRN, CLRN
  ADD10 inst75 (.a(x), .b(inst549_data), .f(xear));
  ADD10 inst76 (.a(y), .b(inst550_data), .f(year));
  MP2X #(.size(4)) inst122 (.S(igrac3), .X0(inst664_y), .X1(Rigr3), .Y(inst122_y));
  MP2X #(.size(4)) inst102 (.S(igrac3), .X0(inst665_y), .X1(Gigr3), .Y(inst102_y));
  MP2X #(.size(4)) asddagfsb123 (.S(igrac3), .X0(inst666_y), .X1(Bigr3), .Y(asddagfsb123_y));
  or inst51 (inst51_out, mval1, mval2, mval3, mval4, mval5, mval6, 1'b0, inst142_out);
  not inst10 (nldsc, ldsc);
  and inst182 (inst182_out, inst51_out, player1imahp);
  or inst96 (inst96_out, mval31, mval32, mval33, mval34, mval35, mval36, 1'b0, 1'b0);
  and inst183 (inst183_out, inst96_out, player3imahp);
  not inst42 (\1 , 1'b0);
  MP2X #(.size(4)) inst101 (.S(igrac2), .X0(inst122_y), .X1(Rigr2), .Y(inst101_y));
  MP2X #(.size(4)) inst9 (.S(igrac2), .X0(inst102_y), .X1(Gigr2), .Y(inst9_y));
  MP2X #(.size(4)) asddagfsb (.S(igrac2), .X0(asddagfsb123_y), .X1(Bigr2), .Y(asddagfsb_y));
  or inst231 (prikazmetka, inst182_out, 1'b0, inst183_out);
  CONSTX #(.size(4), .\const (15)) inst125 (.data(max));
  CONSTX #(.size(4), .\const (0)) inst130 (.data(min));
  CONSTX #(.size(10), .\const (520)) inst132 (.data(inst132_data));
  MP2X #(.size(4)) inst7 (.S(igrac1), .X0(inst101_y), .X1(R2), .Y(inst7_y));
  MP2X #(.size(4)) inst8 (.S(igrac1), .X0(inst9_y), .X1(G2), .Y(inst8_y));
  MP2X #(.size(4)) asdfasd (.S(igrac1), .X0(asddagfsb_y), .X1(B2), .Y(asdfasd_y));
  CONSTX #(.size(10), .\const (657)) inst120 (.data(inst120_data));
  MP2X #(.size(4)) inst18 (.S(prikazmetka), .X0(inst7_y), .X1(R3), .Y(inst18_y));
  MP2X #(.size(4)) inst19 (.S(prikazmetka), .X0(inst8_y), .X1(G3), .Y(inst19_y));
  MP2X #(.size(4)) inst20 (.S(prikazmetka), .X0(asdfasd_y), .X1(B3), .Y(inst20_y));
  HealtyPrikaz inst79 (
    .healtyval({2'b00, healthplayer1[6:0], 1'b0}), .pomeraj(inst132_data), .x(x), .y(y), .valid(hp1));
  HealtyPrikaz inst113 (
    .healtyval({2'b00, healthplayer2[6:0], 1'b0}), .pomeraj(inst120_data), .x(x), .y(y), .valid(hp2));
  MP2X #(.size(4)) inst140 (.S(hp2), .X0(inst18_y), .X1(max), .Y(inst140_y));
  MP2X #(.size(4)) inst135 (.S(hp2), .X0(inst19_y), .X1(min), .Y(inst135_y));
  MP2X #(.size(4)) asdfasd81 (.S(hp2), .X0(inst20_y), .X1(min), .Y(asdfasd81_y));
  CONSTX #(.size(10), .\const (383)) inst181 (.data(inst181_data));
  MP2X #(.size(4)) inst145 (.S(hp1), .X0(inst140_y), .X1(min), .Y(inst145_y));
  MP2X #(.size(4)) inst146 (.S(hp1), .X0(inst135_y), .X1(min), .Y(inst146_y));
  MP2X #(.size(4)) inst147 (.S(hp1), .X0(asdfasd81_y), .X1(max), .Y(inst147_y));
  CONSTX #(.size(4), .\const (3)) inst47 (.data(inst47_data));
  CONSTX #(.size(4), .\const (15)) inst49 (.data(inst49_data));
  CONSTX #(.size(4), .\const (6)) inst50 (.data(inst50_data));
  HealtyPrikaz inst166 (
    .healtyval({2'b00, healthplayer3[6:0], 1'b0}), .pomeraj(inst181_data), .x(x), .y(y), .valid(hp0));
  MP2X #(.size(4)) inst151 (.S(hp0), .X0(inst145_y), .X1(inst47_data), .Y(inst151_y));
  MP2X #(.size(4)) inst157 (.S(hp0), .X0(inst146_y), .X1(inst49_data), .Y(inst157_y));
  MP2X #(.size(4)) inst161 (.S(hp0), .X0(inst147_y), .X1(inst50_data), .Y(inst161_y));
  MP2X #(.size(4)) inst4 (.S(ldsc), .X0(R0), .X1(inst151_y), .Y(VGAR));
  MP2X #(.size(4)) inst12 (.S(ldsc), .X0(G0), .X1(inst157_y), .Y(VGAG));
  MP2X #(.size(4)) inst13 (.S(ldsc), .X0(B0), .X1(inst161_y), .Y(VGAB));

  assign ll1 = 1'b0;

  // Other names for the same wires on the sheet: ENTER2 = ENTER2inp; ENTER3 = ENTER3inp; n21 = n21inp; n22 = n22inp;
  //   n23 = n23inp; n27 = n27inp; n28 = n28inp; n29 = n29inp; n31 = n31inp; n32 = n32inp; n33 = n33inp; n37 = n37inp;
  //   n38 = n38inp; n39 = n39inp; SPACE2 = SPACE2inp; SPACE3 = SPACE3inp
endmodule
